# EAGLE schematic uart board (EAGLE 9.5.2)
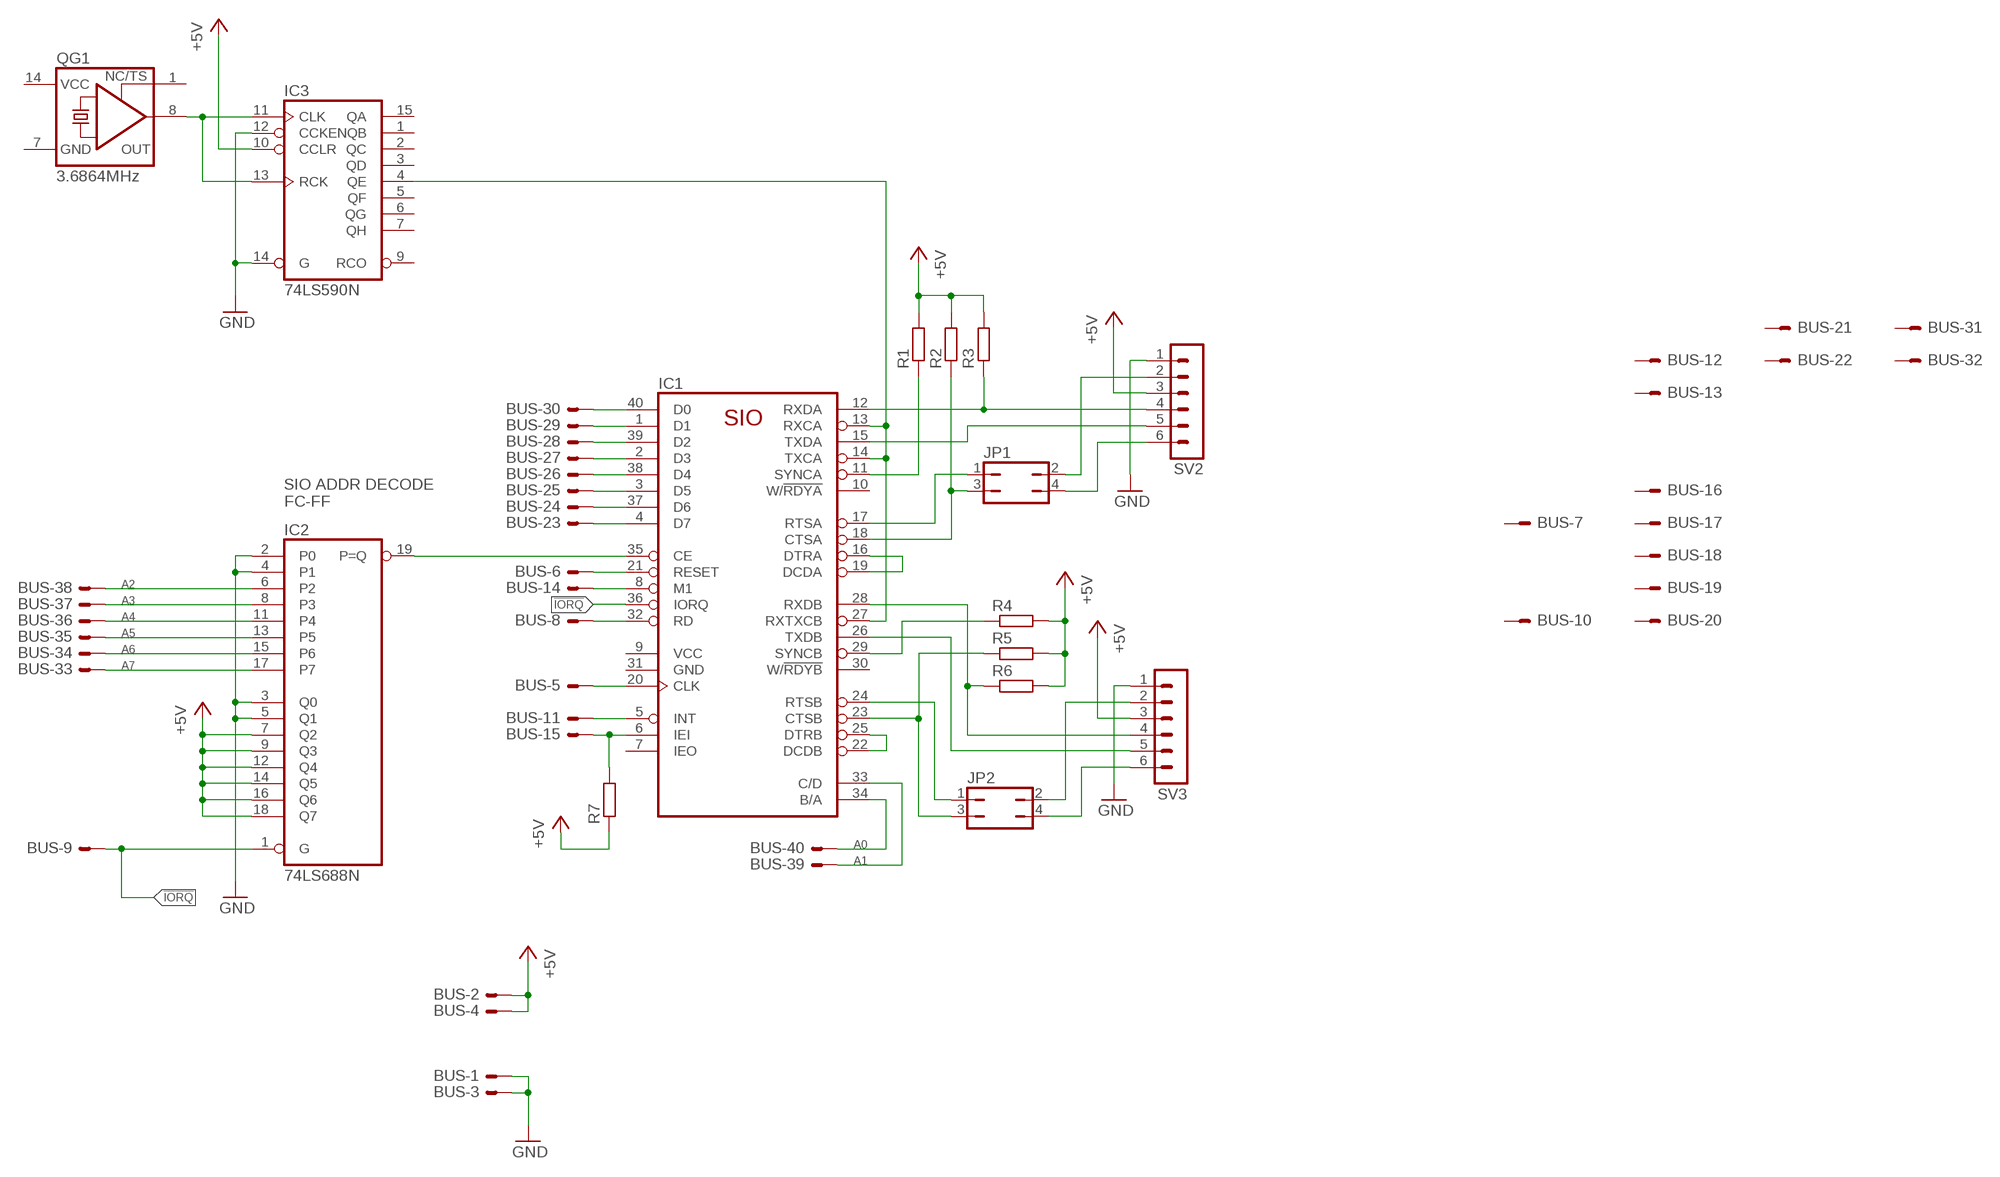
[diagram p0: schematic, sheet 1]

## Parts
BUS  ML40E  [ML40]
IC1  Z80SIO  [DIL40]
IC2  74LS688N  [DIL20]
IC3  74LS590N  [DIL16]
JP1  JP2Q  [JP2Q]
JP2  JP2Q  [JP2Q]
QG1  3.6864MHz  XO-14  [DIL14S]
R1  R-EU_0207/10  [0207/10]
R2  R-EU_0207/10  [0207/10]
R3  R-EU_0207/10  [0207/10]
R4  R-EU_0207/10  [0207/10]
R5  R-EU_0207/10  [0207/10]
R6  R-EU_0207/10  [0207/10]
R7  R-EU_0207/10  [0207/10]
SV2  MA06-1  [MA06-1]
SV3  MA06-1  [MA06-1]

## Nets
!IORQ!: BUS.9 IC1.36(IORQ) IC2.1(G)
+5V: BUS.2 BUS.4 IC2.7(Q2) IC2.9(Q3) IC2.12(Q4) IC2.14(Q5) IC2.16(Q6) IC2.18(Q7) IC3.10(CCLR) R1.2 R2.2 R3.2 R4.2 R5.2 R6.2 R7.1 SV2.3 SV3.3
A0: BUS.40 IC1.34(B/A)
A1: BUS.39 IC1.33(C/D)
A2: BUS.38 IC2.6(P2)
A3: BUS.37 IC2.8(P3)
A4: BUS.36 IC2.11(P4)
A5: BUS.35 IC2.13(P5)
A6: BUS.34 IC2.15(P6)
A7: BUS.33 IC2.17(P7)
GND: BUS.1 BUS.3 IC2.2(P0) IC2.3(Q0) IC2.4(P1) IC2.5(Q1) IC3.12(CCKEN) IC3.14(G) SV2.1 SV3.1
N$1: IC3.11(CLK) IC3.13(RCK) QG1.8(OUT)
N$2: IC1.12(RXDA) R3.1 SV2.4
N$3: IC1.15(TXDA) SV2.5
N$4: IC1.13(RXCA) IC1.14(TXCA) IC1.27(RXTXCB) IC3.4(QE)
N$5: IC1.17(RTSA) JP1.1
N$6: IC1.18(CTSA) JP1.3 R2.1
N$7: JP1.2 SV2.2
N$8: JP1.4 SV2.6
N$9: IC1.16(DTRA) IC1.19(DCDA)
N$10: IC1.24(RTSB) JP2.1
N$11: IC1.23(CTSB) JP2.3 R5.1
N$12: IC1.22(DCDB) IC1.25(DTRB)
N$13: IC1.28(RXDB) R6.1 SV3.4
N$14: IC1.26(TXDB) SV3.5
N$15: IC1.11(SYNCA) R1.1
N$16: BUS.23 IC1.4(D7)
N$17: JP2.2 SV3.2
N$18: JP2.4 SV3.6
N$19: BUS.24 IC1.37(D6)
N$20: IC1.29(SYNCB) R4.1
N$21: BUS.25 IC1.3(D5)
N$22: BUS.26 IC1.38(D4)
N$23: BUS.27 IC1.2(D3)
N$24: BUS.28 IC1.39(D2)
N$25: BUS.29 IC1.1(D1)
N$26: BUS.30 IC1.40(D0)
N$27: BUS.15 IC1.6(IEI) R7.2
N$33: BUS.6 IC1.21(RESET)
N$35: IC1.35(CE) IC2.19(P=Q)
N$36: BUS.14 IC1.8(M1)
N$38: BUS.8 IC1.32(RD)
N$39: BUS.5 IC1.20(CLK)
N$40: BUS.11 IC1.5(INT)
Unconnected: BUS.7 BUS.10 BUS.12 BUS.13 BUS.16 BUS.17 BUS.18 BUS.19 BUS.20 BUS.21 BUS.22 BUS.31 BUS.32 IC1.7(IEO) IC1.10(W/!RDYA) IC1.30(W/!RDYB) IC3.1(QB) IC3.2(QC) IC3.3(QD) IC3.5(QF) IC3.6(QG) IC3.7(QH) IC3.9(RCO) IC3.15(QA) QG1.1(TS)

## Notes on the sheet
- SIO ADDR DECODE
  FC-FF

## Power pins joined to a net without a drawn wire
GND: IC1.31(GND) IC2.10(GND) IC3.8(GND) QG1.7(GND)
VCC: IC1.9(VCC) IC2.20(VCC) IC3.16(VCC) QG1.14(VCC)

## Library data of the parts
BUS = con-ml:ML40E: HARTING; OC_FARNELL: unknown; OC_NEWARK: unknown
IC1 = zilog:Z80SIO: Z80 FAMILY DEVICE
IC2 = 74xx-us:74*688: 8-bit MAGNITUDE/IDENTITY COMPARATOR, totem pole
IC3 = 74xx-us:74*590: 8-bit binary COUNTER, output register
JP1 JP2 = jumper:JP2Q: JUMPER
QG1 = crystal:XO-: CRYSTAL; OC_FARNELL: unknown; OC_NEWARK: unknown
R1-R7 = rcl:R-EU_: RESISTOR, European symbol
SV2 SV3 = con-lstb:MA06-1: PIN HEADER; OC_FARNELL: unknown; OC_NEWARK: unknown